# EAGLE schematic 1-13-2013 (EAGLE 6.4)
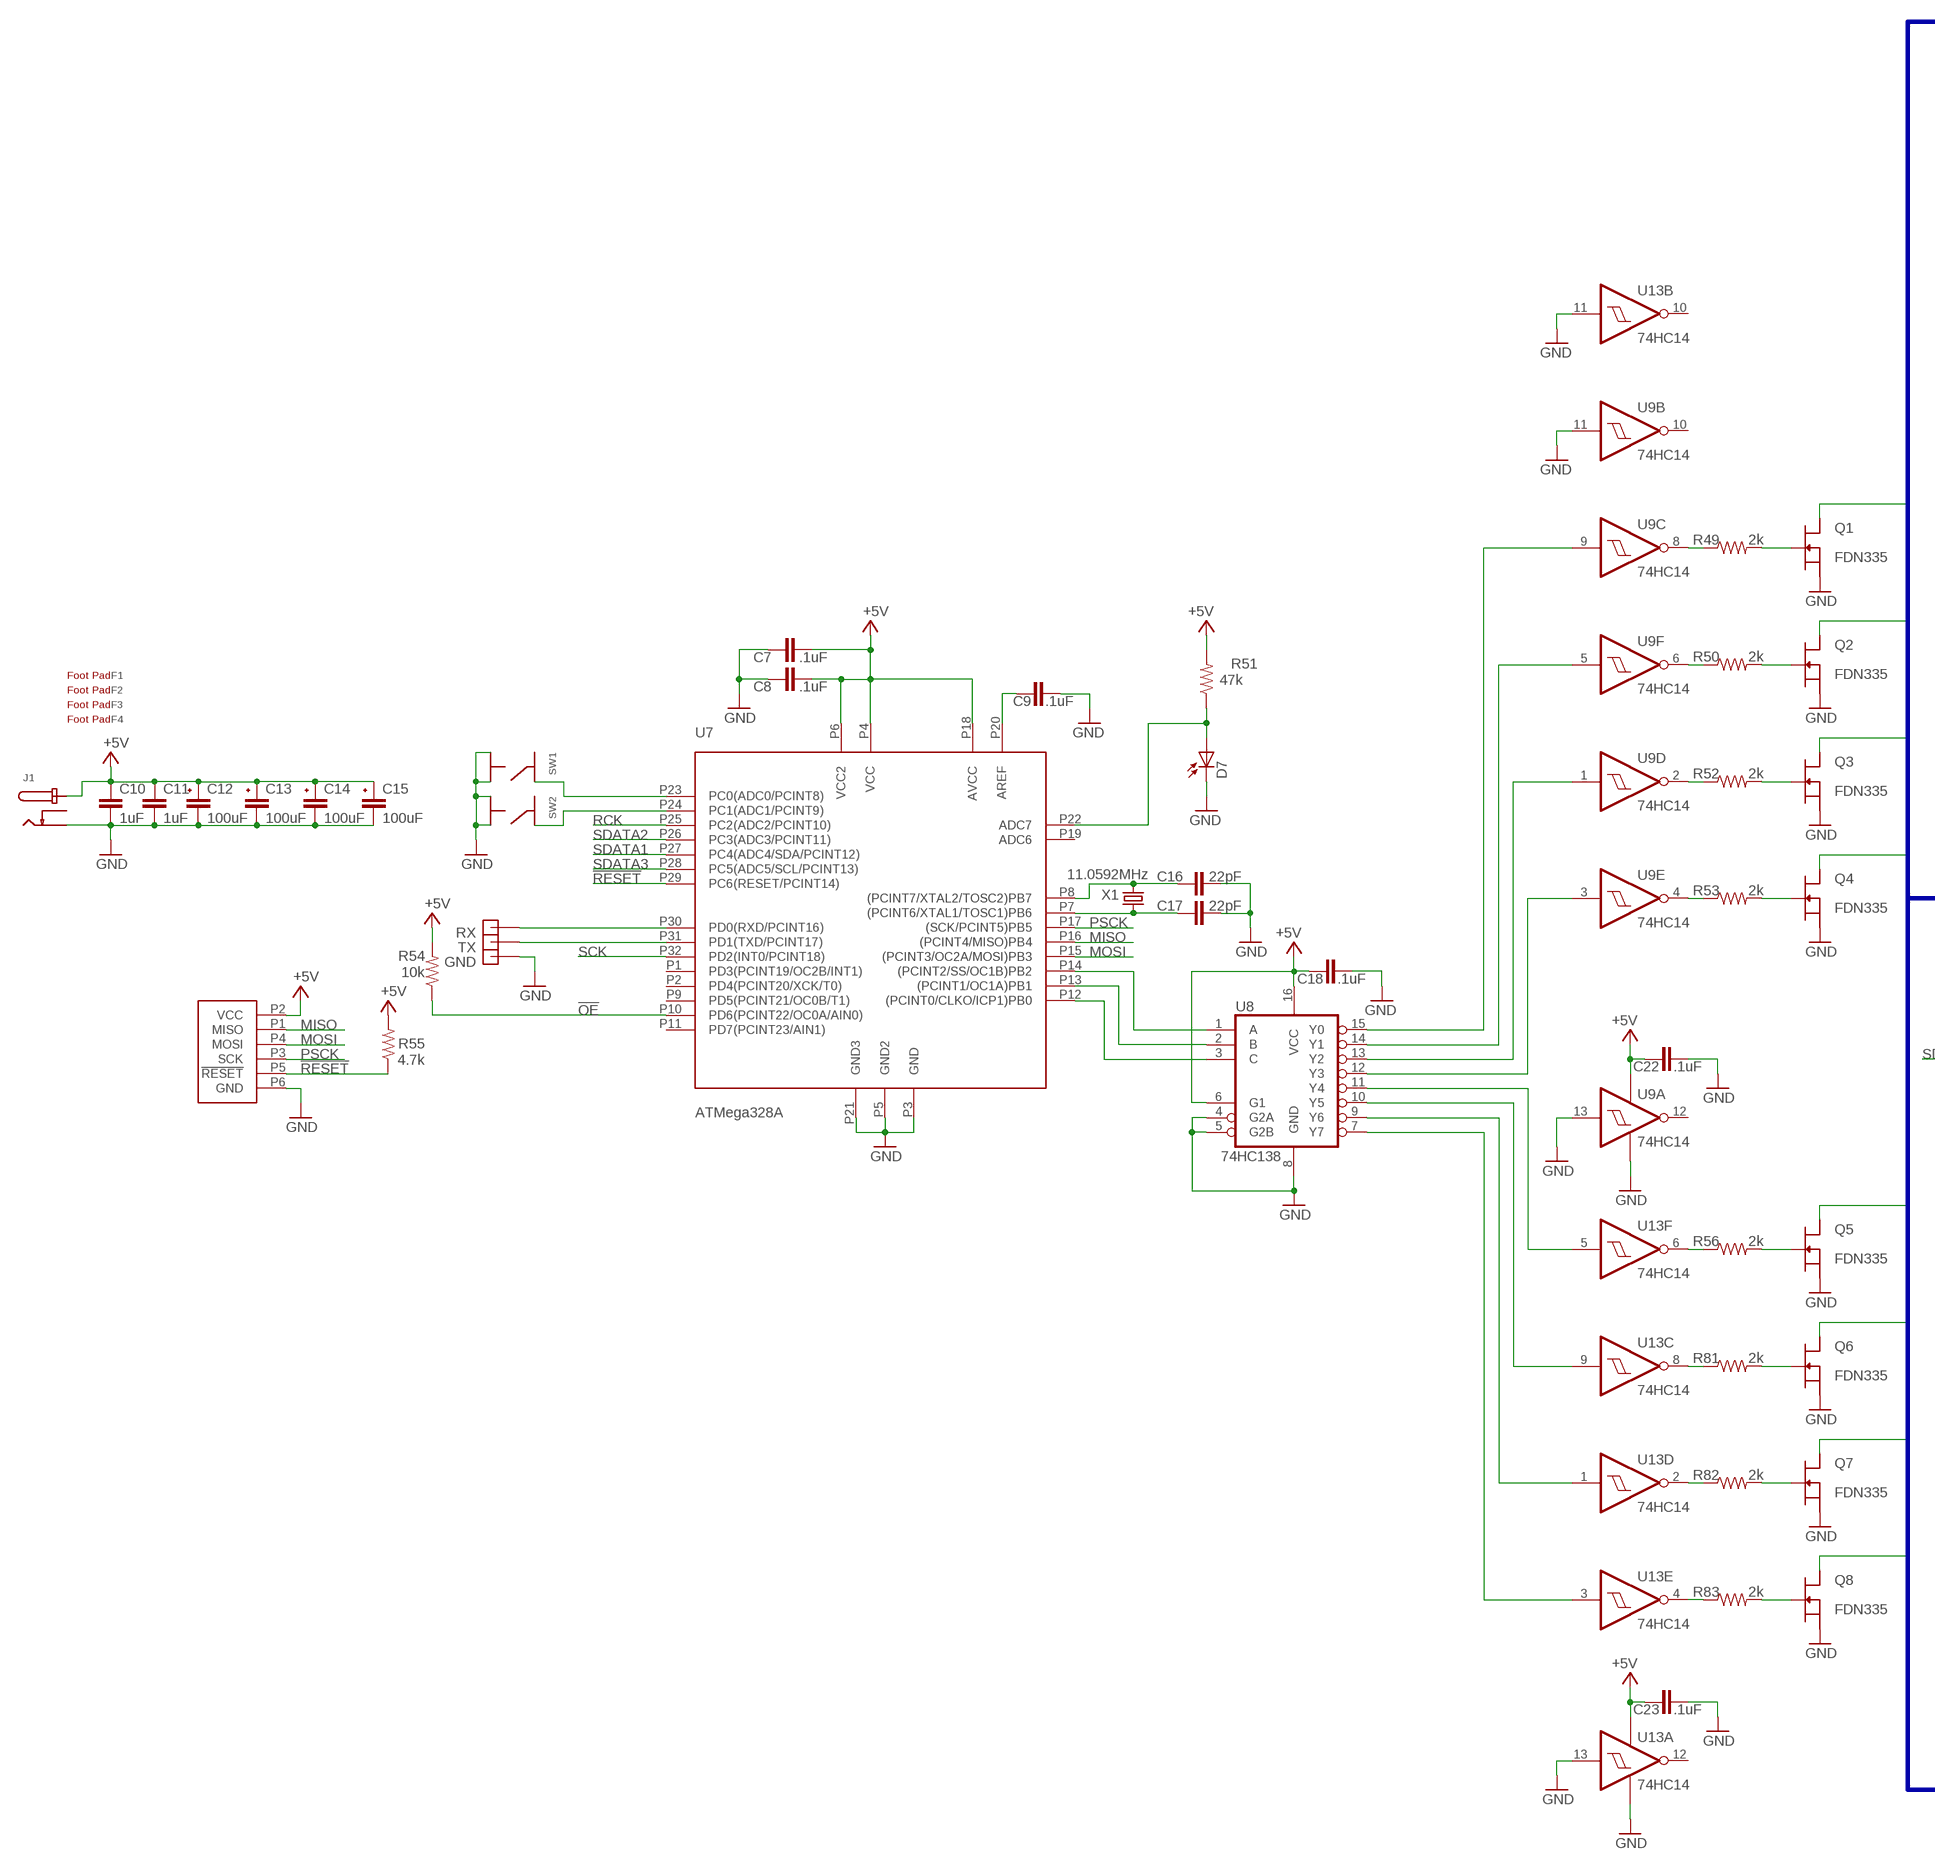
[diagram p0: schematic, sheet 1, part 1 of 2]
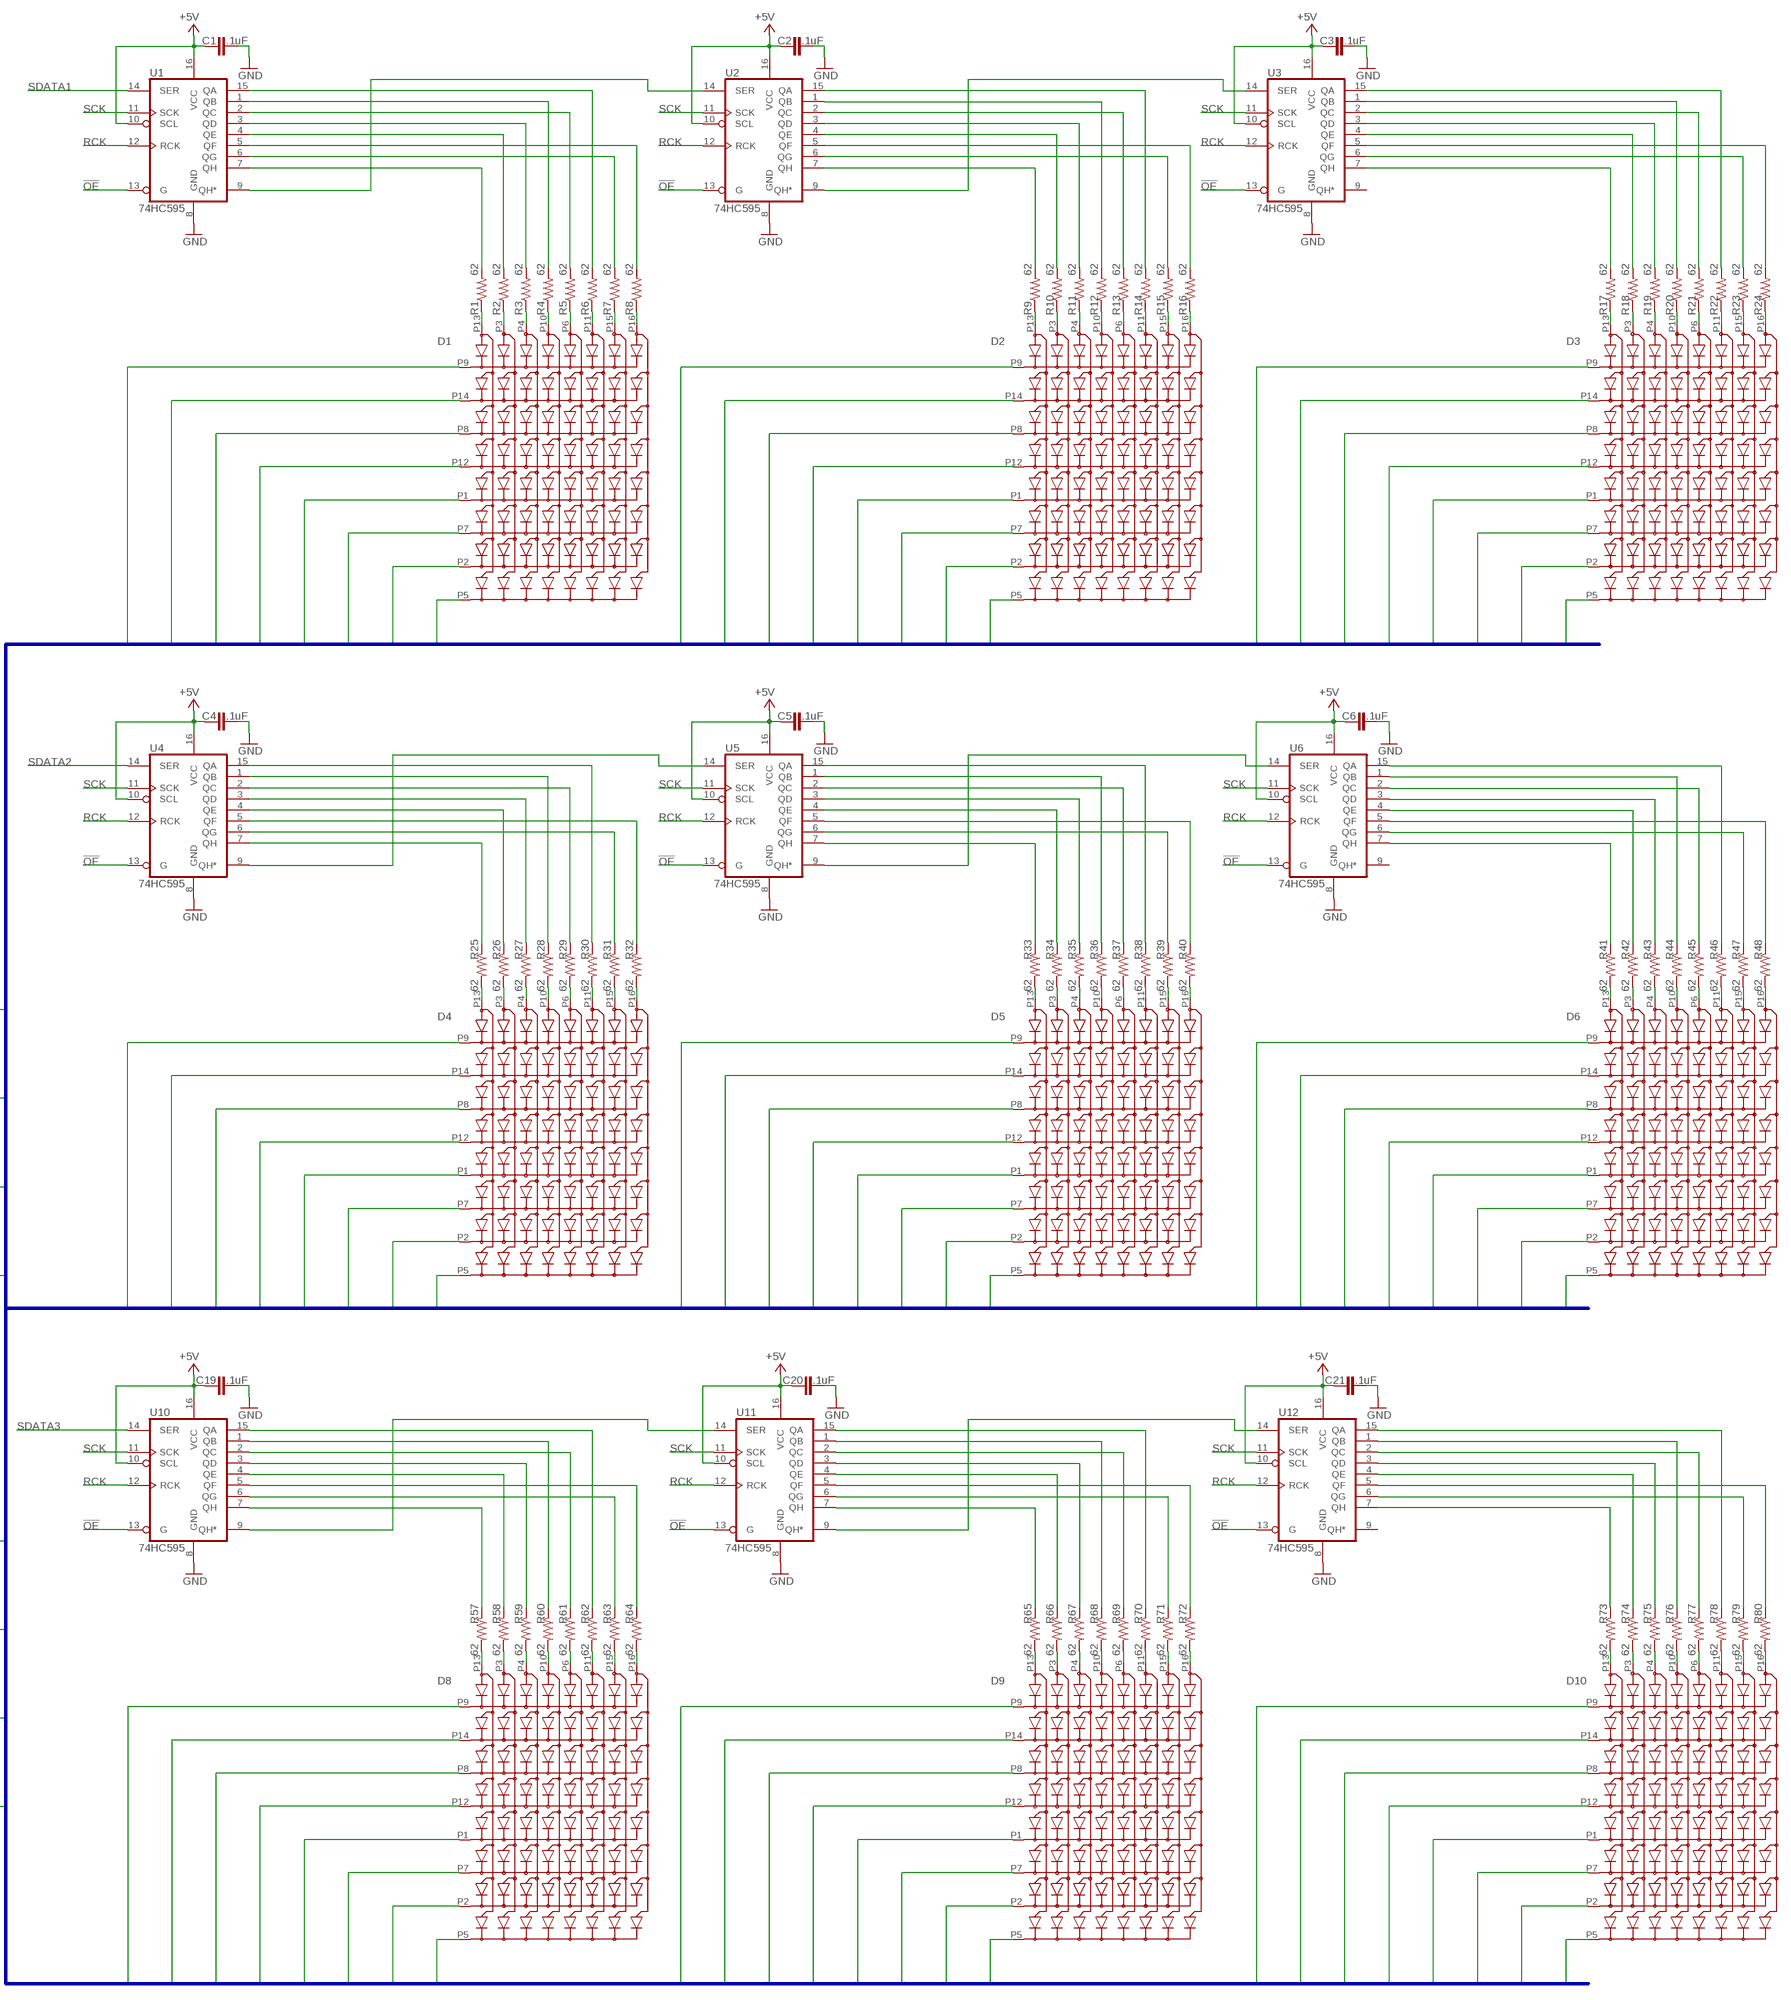
[diagram p1: schematic, sheet 1, part 2 of 2]

## Parts
C1  .1uF  CAPACITOR-.1UF  [0603/1608METRIC]
C2  .1uF  CAPACITOR-.1UF  [0603/1608METRIC]
C3  .1uF  CAPACITOR-.1UF  [0603/1608METRIC]
C4  .1uF  CAPACITOR-.1UF  [0603/1608METRIC]
C5  .1uF  CAPACITOR-.1UF  [0603/1608METRIC]
C6  .1uF  CAPACITOR-.1UF  [0603/1608METRIC]
C7  .1uF  CAPACITOR-.1UF  [0603/1608METRIC]
C8  .1uF  CAPACITOR-.1UF  [0603/1608METRIC]
C9  .1uF  CAPACITOR-.1UF  [0603/1608METRIC]
C10  1uF  CAPACITOR-1UF  [0603/1608METRIC]
C11  1uF  CAPACITOR-1UF  [0603/1608METRIC]
C12  100uF  ELEC-100UF-SMT  [CAP-UWX-6.3]
C13  100uF  ELEC-100UF-SMT  [CAP-UWX-6.3]
C14  100uF  ELEC-100UF-SMT  [CAP-UWX-6.3]
C15  100uF  ELEC-100UF-SMT  [CAP-UWX-6.3]
C16  22pF  CAPACITOR-22PF  [0603/1608METRIC]
C17  22pF  CAPACITOR-22PF  [0603/1608METRIC]
C18  .1uF  CAPACITOR-.1UF  [0603/1608METRIC]
C19  .1uF  CAPACITOR-.1UF  [0603/1608METRIC]
C20  .1uF  CAPACITOR-.1UF  [0603/1608METRIC]
C21  .1uF  CAPACITOR-.1UF  [0603/1608METRIC]
C22  .1uF  CAPACITOR-.1UF  [0603/1608METRIC]
C23  .1uF  CAPACITOR-.1UF  [0603/1608METRIC]
D1  WHITE  HS-2085AWND-  [HS-2085BX]
D2  WHITE  HS-2085AWND-  [HS-2085BX]
D3  WHITE  HS-2085AWND-  [HS-2085BX]
D4  WHITE  HS-2085AWND-  [HS-2085BX]
D5  WHITE  HS-2085AWND-  [HS-2085BX]
D6  WHITE  HS-2085AWND-  [HS-2085BX]
D7  TEPT4400  [LED3MM]
D8  WHITE  HS-2085AWND-  [HS-2085BX]
D9  WHITE  HS-2085AWND-  [HS-2085BX]
D10  WHITE  HS-2085AWND-  [HS-2085BX]
F1  RUBBER-FOOT  [SJ-5518]
F2  RUBBER-FOOT  [SJ-5518]
F3  RUBBER-FOOT  [SJ-5518]
F4  RUBBER-FOOT  [SJ-5518]
GND  HEADERPIN  [HEADERPIN]
J1  DC-BARREL-JACK-SWITCH  [PJ-075DH-SMT-TR]
J2  PROGHEADER-PINS  [ATMEL-PROGRAMMING-HEADER]
Q1  FDN335  [SOT23]
Q2  FDN335  [SOT23]
Q3  FDN335  [SOT23]
Q4  FDN335  [SOT23]
Q5  FDN335  [SOT23]
Q6  FDN335  [SOT23]
Q7  FDN335  [SOT23]
Q8  FDN335  [SOT23]
R1  62  RESISTOR-62-5%-0603  [0603/1608METRIC]
R2  62  RESISTOR-62-5%-0603  [0603/1608METRIC]
R3  62  RESISTOR-62-5%-0603  [0603/1608METRIC]
R4  62  RESISTOR-62-5%-0603  [0603/1608METRIC]
R5  62  RESISTOR-62-5%-0603  [0603/1608METRIC]
R6  62  RESISTOR-62-5%-0603  [0603/1608METRIC]
R7  62  RESISTOR-62-5%-0603  [0603/1608METRIC]
R8  62  RESISTOR-62-5%-0603  [0603/1608METRIC]
R9  62  RESISTOR-62-5%-0603  [0603/1608METRIC]
R10  62  RESISTOR-62-5%-0603  [0603/1608METRIC]
R11  62  RESISTOR-62-5%-0603  [0603/1608METRIC]
R12  62  RESISTOR-62-5%-0603  [0603/1608METRIC]
R13  62  RESISTOR-62-5%-0603  [0603/1608METRIC]
R14  62  RESISTOR-62-5%-0603  [0603/1608METRIC]
R15  62  RESISTOR-62-5%-0603  [0603/1608METRIC]
R16  62  RESISTOR-62-5%-0603  [0603/1608METRIC]
R17  62  RESISTOR-62-5%-0603  [0603/1608METRIC]
R18  62  RESISTOR-62-5%-0603  [0603/1608METRIC]
R19  62  RESISTOR-62-5%-0603  [0603/1608METRIC]
R20  62  RESISTOR-62-5%-0603  [0603/1608METRIC]
R21  62  RESISTOR-62-5%-0603  [0603/1608METRIC]
R22  62  RESISTOR-62-5%-0603  [0603/1608METRIC]
R23  62  RESISTOR-62-5%-0603  [0603/1608METRIC]
R24  62  RESISTOR-62-5%-0603  [0603/1608METRIC]
R25  62  RESISTOR-62-5%-0603  [0603/1608METRIC]
R26  62  RESISTOR-62-5%-0603  [0603/1608METRIC]
R27  62  RESISTOR-62-5%-0603  [0603/1608METRIC]
R28  62  RESISTOR-62-5%-0603  [0603/1608METRIC]
R29  62  RESISTOR-62-5%-0603  [0603/1608METRIC]
R30  62  RESISTOR-62-5%-0603  [0603/1608METRIC]
R31  62  RESISTOR-62-5%-0603  [0603/1608METRIC]
R32  62  RESISTOR-62-5%-0603  [0603/1608METRIC]
R33  62  RESISTOR-62-5%-0603  [0603/1608METRIC]
R34  62  RESISTOR-62-5%-0603  [0603/1608METRIC]
R35  62  RESISTOR-62-5%-0603  [0603/1608METRIC]
R36  62  RESISTOR-62-5%-0603  [0603/1608METRIC]
R37  62  RESISTOR-62-5%-0603  [0603/1608METRIC]
R38  62  RESISTOR-62-5%-0603  [0603/1608METRIC]
R39  62  RESISTOR-62-5%-0603  [0603/1608METRIC]
R40  62  RESISTOR-62-5%-0603  [0603/1608METRIC]
R41  62  RESISTOR-62-5%-0603  [0603/1608METRIC]
R42  62  RESISTOR-62-5%-0603  [0603/1608METRIC]
R43  62  RESISTOR-62-5%-0603  [0603/1608METRIC]
R44  62  RESISTOR-62-5%-0603  [0603/1608METRIC]
R45  62  RESISTOR-62-5%-0603  [0603/1608METRIC]
R46  62  RESISTOR-62-5%-0603  [0603/1608METRIC]
R47  62  RESISTOR-62-5%-0603  [0603/1608METRIC]
R48  62  RESISTOR-62-5%-0603  [0603/1608METRIC]
R49  2k  RESISTOR-2K-5%-0603  [0603/1608METRIC]
R50  2k  RESISTOR-2K-5%-0603  [0603/1608METRIC]
R51  47k  RESISTOR-47K-5%-0603  [0603/1608METRIC]
R52  2k  RESISTOR-2K-5%-0603  [0603/1608METRIC]
R53  2k  RESISTOR-2K-5%-0603  [0603/1608METRIC]
R54  10k  RESISTOR-10K-5%-0603  [0603/1608METRIC]
R55  4.7k  RESISTOR-4.7K-5%-0603  [0603/1608METRIC]
R56  2k  RESISTOR-2K-5%-0603  [0603/1608METRIC]
R57  62  RESISTOR-62-5%-0603  [0603/1608METRIC]
R58  62  RESISTOR-62-5%-0603  [0603/1608METRIC]
R59  62  RESISTOR-62-5%-0603  [0603/1608METRIC]
R60  62  RESISTOR-62-5%-0603  [0603/1608METRIC]
R61  62  RESISTOR-62-5%-0603  [0603/1608METRIC]
R62  62  RESISTOR-62-5%-0603  [0603/1608METRIC]
R63  62  RESISTOR-62-5%-0603  [0603/1608METRIC]
R64  62  RESISTOR-62-5%-0603  [0603/1608METRIC]
R65  62  RESISTOR-62-5%-0603  [0603/1608METRIC]
R66  62  RESISTOR-62-5%-0603  [0603/1608METRIC]
R67  62  RESISTOR-62-5%-0603  [0603/1608METRIC]
R68  62  RESISTOR-62-5%-0603  [0603/1608METRIC]
R69  62  RESISTOR-62-5%-0603  [0603/1608METRIC]
R70  62  RESISTOR-62-5%-0603  [0603/1608METRIC]
R71  62  RESISTOR-62-5%-0603  [0603/1608METRIC]
R72  62  RESISTOR-62-5%-0603  [0603/1608METRIC]
R73  62  RESISTOR-62-5%-0603  [0603/1608METRIC]
R74  62  RESISTOR-62-5%-0603  [0603/1608METRIC]
R75  62  RESISTOR-62-5%-0603  [0603/1608METRIC]
R76  62  RESISTOR-62-5%-0603  [0603/1608METRIC]
R77  62  RESISTOR-62-5%-0603  [0603/1608METRIC]
R78  62  RESISTOR-62-5%-0603  [0603/1608METRIC]
R79  62  RESISTOR-62-5%-0603  [0603/1608METRIC]
R80  62  RESISTOR-62-5%-0603  [0603/1608METRIC]
R81  2k  RESISTOR-2K-5%-0603  [0603/1608METRIC]
R82  2k  RESISTOR-2K-5%-0603  [0603/1608METRIC]
R83  2k  RESISTOR-2K-5%-0603  [0603/1608METRIC]
RX  HEADERPIN  [HEADERPIN]
SW1  4mm  SWITCH-TACT-SM  [PTS645SM43SMTRLFS]
SW2  4mm  SWITCH-TACT-SM  [PTS645SM43SMTRLFS]
TX  HEADERPIN  [HEADERPIN]
U1  74HC595  74HC595-SOIC  [SO16]
U2  74HC595  74HC595-SOIC  [SO16]
U3  74HC595  74HC595-SOIC  [SO16]
U4  74HC595  74HC595-SOIC  [SO16]
U5  74HC595  74HC595-SOIC  [SO16]
U6  74HC595  74HC595-SOIC  [SO16]
U7  ATMega328A  ATMEGA328A  [TQFP-32]
U8  74HC138  74HC138-SOIC  [SO16]
U9  74HC14  74HC14-SOIC  [SO14]
U10  74HC595  74HC595-SOIC  [SO16]
U11  74HC595  74HC595-SOIC  [SO16]
U12  74HC595  74HC595-SOIC  [SO16]
U13  74HC14  74HC14-SOIC  [SO14]
X1  11.0592MHz  XTAL9C-T  [HC49UP]

## Nets
!OE: R54.P1 U1.13(G) U2.13(G) U3.13(G) U4.13(G) U5.13(G) U6.13(G) U7.P10(PD6(PCINT22/OC0A/AIN0)) U10.13(G) U11.13(G) U12.13(G)
!RESET: J2.P5(!RESET) R55.P1 U7.P29(PC6(RESET/PCINT14))
+5V: C1.P1 C2.P1 C3.P1 C4.P1 C5.P1 C6.P1 C7.P1 C8.P1 C10.P1 C11.P1 C12.+ C13.+ C14.+ C15.+ C18.P1 C19.P1 C20.P1 C21.P1 C22.P1 C23.P1 J1.1(PIN) J2.P2(VCC) R51.P2 R54.P2 R55.P2 U1.10(SCL) U1.16(VCC) U2.10(SCL) U2.16(VCC) U3.10(SCL) U3.16(VCC) U4.10(SCL) U4.16(VCC) U5.10(SCL) U5.16(VCC) U6.10(SCL) U6.16(VCC) U7.P4(VCC) U7.P6(VCC2) U7.P18(AVCC) U8.6(G1) U8.16(VCC) U9.14(A:VCC) U10.10(SCL) U10.16(VCC) U11.10(SCL) U11.16(VCC) U12.10(SCL) U12.16(VCC) U13.14(A:VCC)
GND: C1.P2 C2.P2 C3.P2 C4.P2 C5.P2 C6.P2 C7.P2 C8.P2 C9.P2 C10.P2 C11.P2 C12.- C13.- C14.- C15.- C16.P2 C17.P2 C18.P2 C19.P2 C20.P2 C21.P2 C22.P2 C23.P2 D7.K(C) GND.P$1 J1.2(BARREL) J2.P6(GND) Q1.2(S) Q2.2(S) Q3.2(S) Q4.2(S) Q5.2(S) Q6.2(S) Q7.2(S) Q8.2(S) SW1.P3 SW1.P4 SW2.P3 SW2.P4 U1.8(GND) U2.8(GND) U3.8(GND) U4.8(GND) U5.8(GND) U6.8(GND) U7.P3(GND) U7.P5(GND2) U7.P21(GND3) U8.4(G2A) U8.5(G2B) U8.8(GND) U9.7(A:GND) U9.11(B:I) U9.13(A:I) U10.8(GND) U11.8(GND) U12.8(GND) U13.7(A:GND) U13.11(B:I) U13.13(A:I)
MISO: J2.P1(MISO) U7.P16((PCINT4/MISO)PB4)
MOSI: J2.P4(MOSI) U7.P15((PCINT3/OC2A/MOSI)PB3)
N$1: D1.P13(C1) R1.P1
N$2: R4.P2 U1.1(QB)
N$3: D1.P3(C2) R2.P1
N$4: R5.P2 U1.2(QC)
N$5: D1.P4(C3) R3.P1
N$6: R14.P2 U2.15(QA)
N$7: D1.P10(C4) R4.P1
N$8: R13.P2 U2.2(QC)
N$9: D1.P6(C5) R5.P1
N$10: R12.P2 U2.1(QB)
N$11: D1.P11(C6) R6.P1
N$12: R11.P2 U2.3(QD)
N$13: D1.P15(C7) R7.P1
N$14: R10.P2 U2.4(QE)
N$15: D1.P16(C8) R8.P1
N$16: R16.P2 U2.5(QF)
N$17: U8.15(Y0) U9.9(C:I)
N$18: D2.P13(C1) R9.P1
N$19: R21.P2 U3.2(QC)
N$20: D2.P3(C2) R10.P1
N$21: R20.P2 U3.1(QB)
N$22: D2.P4(C3) R11.P1
N$23: R19.P2 U3.3(QD)
N$24: D2.P10(C4) R12.P1
N$25: R18.P2 U3.4(QE)
N$26: D2.P6(C5) R13.P1
N$27: R24.P2 U3.5(QF)
N$28: D2.P11(C6) R14.P1
N$29: R32.P1 U4.5(QF)
N$30: D2.P15(C7) R15.P1
N$31: R25.P1 U4.7(QH)
N$32: D2.P16(C8) R16.P1
N$33: R52.P1 U9.2(D:O)
N$34: R50.P1 U9.6(F:O)
N$35: R49.P1 U9.8(C:O)
N$36: R53.P1 U9.4(E:O)
N$37: R83.P1 U13.4(E:O)
N$38: R82.P1 U13.2(D:O)
N$39: R81.P1 U13.8(C:O)
N$40: R56.P1 U13.6(F:O)
N$41: C17.P1 U7.P7((PCINT6/XTAL1/TOSC1)PB6) X1.1
N$42: R7.P2 U1.6(QG)
N$43: TX.P$1 U7.P31(PD1(TXD/PCINT17))
N$44: C16.P1 U7.P8((PCINT7/XTAL2/TOSC2)PB7) X1.2
N$45: RX.P$1 U7.P30(PD0(RXD/PCINT16))
N$46: Q3.1(G) R52.P2
N$47: SW2.P2 U7.P24(PC1(ADC1/PCINT9))
N$48: SW1.P2 U7.P23(PC0(ADC0/PCINT8))
N$49: R1.P2 U1.7(QH)
N$50: Q1.1(G) R49.P2
N$51: R8.P2 U1.5(QF)
N$52: R2.P2 U1.4(QE)
N$53: R3.P2 U1.3(QD)
N$54: R31.P1 U4.6(QG)
N$55: R26.P1 U4.4(QE)
N$56: R6.P2 U1.15(QA)
N$57: R27.P1 U4.3(QD)
N$58: R29.P1 U4.2(QC)
N$59: R30.P1 U4.15(QA)
N$60: R33.P1 U5.7(QH)
N$61: R39.P1 U5.6(QG)
N$62: R40.P1 U5.5(QF)
N$63: R34.P1 U5.4(QE)
N$64: R35.P1 U5.3(QD)
N$65: R36.P1 U5.1(QB)
N$66: R37.P1 U5.2(QC)
N$67: R38.P1 U5.15(QA)
N$68: R41.P1 U6.7(QH)
N$69: R47.P1 U6.6(QG)
N$70: R46.P1 U6.15(QA)
N$71: R45.P1 U6.2(QC)
N$72: R44.P1 U6.1(QB)
N$73: R43.P1 U6.3(QD)
N$74: U8.14(Y1) U9.5(F:I)
N$75: U4.9(QH*) U5.14(SER)
N$76: U5.9(QH*) U6.14(SER)
N$77: U8.13(Y2) U9.1(D:I)
N$78: U1.9(QH*) U2.14(SER)
N$79: U2.9(QH*) U3.14(SER)
N$80: R42.P1 U6.4(QE)
N$81: R48.P1 U6.5(QF)
N$82: R57.P1 U10.7(QH)
N$83: R63.P1 U10.6(QG)
N$84: R64.P1 U10.5(QF)
N$85: R58.P1 U10.4(QE)
N$86: R59.P1 U10.3(QD)
N$87: R15.P2 U2.6(QG)
N$88: R61.P1 U10.2(QC)
N$89: R60.P1 U10.1(QB)
N$90: R62.P1 U10.15(QA)
N$91: R65.P1 U11.7(QH)
N$92: R71.P1 U11.6(QG)
N$93: R72.P1 U11.5(QF)
N$94: R66.P1 U11.4(QE)
N$95: R67.P1 U11.3(QD)
N$96: R69.P1 U11.2(QC)
N$97: R9.P2 U2.7(QH)
N$98: R68.P1 U11.1(QB)
N$99: R70.P1 U11.15(QA)
N$100: R73.P1 U12.7(QH)
N$101: R79.P1 U12.6(QG)
N$102: R80.P1 U12.5(QF)
N$103: R74.P1 U12.4(QE)
N$104: R75.P1 U12.3(QD)
N$105: R77.P1 U12.2(QC)
N$106: R76.P1 U12.1(QB)
N$107: R78.P1 U12.15(QA)
N$121: U10.9(QH*) U11.14(SER)
N$122: U11.9(QH*) U12.14(SER)
N$123: U8.12(Y3) U9.3(E:I)
N$124: U8.11(Y4) U13.5(F:I)
N$125: U8.10(Y5) U13.9(C:I)
N$126: U8.9(Y6) U13.1(D:I)
N$127: U8.7(Y7) U13.3(E:I)
N$128: D7.A R51.P1 U7.P22(ADC7)
N$129: D3.P13(C1) R17.P1
N$131: D3.P3(C2) R18.P1
N$133: D3.P4(C3) R19.P1
N$135: D3.P10(C4) R20.P1
N$137: D3.P6(C5) R21.P1
N$139: D3.P11(C6) R22.P1
N$141: D3.P15(C7) R23.P1
N$143: D3.P16(C8) R24.P1
N$161: R17.P2 U3.7(QH)
N$162: R23.P2 U3.6(QG)
N$168: R22.P2 U3.15(QA)
N$185: U7.P12((PCINT0/CLKO/ICP1)PB0) U8.3(C)
N$186: U7.P13((PCINT1/OC1A)PB1) U8.2(B)
N$187: U7.P14((PCINT2/SS/OC1B)PB2) U8.1(A)
N$188: C9.P1 U7.P20(AREF)
N$193: D4.P13(C1) R25.P2
N$195: D4.P3(C2) R26.P2
N$197: D4.P4(C3) R27.P2
N$199: D4.P10(C4) R28.P2
N$201: D4.P6(C5) R29.P2
N$203: D4.P11(C6) R30.P2
N$205: D4.P15(C7) R31.P2
N$207: D4.P16(C8) R32.P2
N$210: R28.P1 U4.1(QB)
N$242: Q7.1(G) R82.P2
N$243: Q2.1(G) R50.P2
N$245: Q4.1(G) R53.P2
N$246: Q5.1(G) R56.P2
N$247: Q6.1(G) R81.P2
N$248: Q8.1(G) R83.P2
N$252: D5.P13(C1) R33.P2
N$254: D5.P3(C2) R34.P2
N$256: D5.P4(C3) R35.P2
N$258: D5.P10(C4) R36.P2
N$260: D5.P6(C5) R37.P2
N$262: D5.P11(C6) R38.P2
N$264: D5.P15(C7) R39.P2
N$266: D5.P16(C8) R40.P2
N$308: D6.P13(C1) R41.P2
N$310: D6.P3(C2) R42.P2
N$312: D6.P4(C3) R43.P2
N$314: D6.P10(C4) R44.P2
N$316: D6.P6(C5) R45.P2
N$318: D6.P11(C6) R46.P2
N$320: D6.P15(C7) R47.P2
N$322: D6.P16(C8) R48.P2
N$369: D8.P13(C1) R57.P2
N$371: D8.P3(C2) R58.P2
N$373: D8.P4(C3) R59.P2
N$375: D8.P10(C4) R60.P2
N$377: D8.P6(C5) R61.P2
N$379: D8.P11(C6) R62.P2
N$381: D8.P15(C7) R63.P2
N$383: D8.P16(C8) R64.P2
N$428: D9.P13(C1) R65.P2
N$430: D9.P3(C2) R66.P2
N$432: D9.P4(C3) R67.P2
N$434: D9.P10(C4) R68.P2
N$436: D9.P6(C5) R69.P2
N$438: D9.P11(C6) R70.P2
N$440: D9.P15(C7) R71.P2
N$442: D9.P16(C8) R72.P2
N$484: D10.P13(C1) R73.P2
N$486: D10.P3(C2) R74.P2
N$488: D10.P4(C3) R75.P2
N$490: D10.P10(C4) R76.P2
N$492: D10.P6(C5) R77.P2
N$494: D10.P11(C6) R78.P2
N$496: D10.P15(C7) R79.P2
N$498: D10.P16(C8) R80.P2
PSCK: J2.P3(SCK) U7.P17((SCK/PCINT5)PB5)
RCK: U1.12(RCK) U2.12(RCK) U3.12(RCK) U4.12(RCK) U5.12(RCK) U6.12(RCK) U7.P25(PC2(ADC2/PCINT10)) U10.12(RCK) U11.12(RCK) U12.12(RCK)
ROW0: D1.P9(R1) D2.P9(R1) D3.P9(R1) D4.P9(R1) D5.P9(R1) D6.P9(R1) D8.P9(R1) D9.P9(R1) D10.P9(R1) Q1.3(D)
ROW1: D1.P14(R2) D2.P14(R2) D3.P14(R2) D4.P14(R2) D5.P14(R2) D6.P14(R2) D8.P14(R2) D9.P14(R2) D10.P14(R2) Q2.3(D)
ROW2: D1.P8(R3) D2.P8(R3) D3.P8(R3) D4.P8(R3) D5.P8(R3) D6.P8(R3) D8.P8(R3) D9.P8(R3) D10.P8(R3) Q3.3(D)
ROW3: D1.P12(R4) D2.P12(R4) D3.P12(R4) D4.P12(R4) D5.P12(R4) D6.P12(R4) D8.P12(R4) D9.P12(R4) D10.P12(R4) Q4.3(D)
ROW4: D1.P1(R5) D2.P1(R5) D3.P1(R5) D4.P1(R5) D5.P1(R5) D6.P1(R5) D8.P1(R5) D9.P1(R5) D10.P1(R5) Q5.3(D)
ROW5: D1.P7(R6) D2.P7(R6) D3.P7(R6) D4.P7(R6) D5.P7(R6) D6.P7(R6) D8.P7(R6) D9.P7(R6) D10.P7(R6) Q6.3(D)
ROW6: D1.P2(R7) D2.P2(R7) D3.P2(R7) D4.P2(R7) D5.P2(R7) D6.P2(R7) D8.P2(R7) D9.P2(R7) D10.P2(R7) Q7.3(D)
ROW7: D1.P5(R8) D2.P5(R8) D3.P5(R8) D4.P5(R8) D5.P5(R8) D6.P5(R8) D8.P5(R8) D9.P5(R8) D10.P5(R8) Q8.3(D)
SCK: U1.11(SCK) U2.11(SCK) U3.11(SCK) U4.11(SCK) U5.11(SCK) U6.11(SCK) U7.P32(PD2(INT0/PCINT18)) U10.11(SCK) U11.11(SCK) U12.11(SCK)
SDATA1: U1.14(SER) U7.P27(PC4(ADC4/SDA/PCINT12))
SDATA2: U4.14(SER) U7.P26(PC3(ADC3/PCINT11))
SDATA3: U7.P28(PC5(ADC5/SCL/PCINT13)) U10.14(SER)
Unconnected: J1.3(SWITCH) SW1.P1 SW2.P1 U3.9(QH*) U6.9(QH*) U7.P1(PD3(PCINT19/OC2B/INT1)) U7.P2(PD4(PCINT20/XCK/T0)) U7.P9(PD5(PCINT21/OC0B/T1)) U7.P11(PD7(PCINT23/AIN1)) U7.P19(ADC6) U9.10(B:O) U9.12(A:O) U12.9(QH*) U13.10(B:O) U13.12(A:O)

## Buses
ROW[0..7]

## Library data of the parts
C1-C9 C18-C23 = ciuffocapacitor:CAPACITOR-*: Capacitor; DISTRIBUTOR: Digikey; DISTRIBUTORPARTNO: 478-1239-1-ND; MANUFACTURER: AVX Corporation; MNT-TYPE: SM; NO-PINS: 2; PACKAGE: 0603 (1608 Metric); TOLERANCE: 10%
C10 C11 = ciuffocapacitor:CAPACITOR-*: Capacitor; DISTRIBUTOR: Digikey; DISTRIBUTORPARTNO: 445-1328-1-ND; MANUFACTURER: TDK CORPORATION; MNT-TYPE: SM; NO-PINS: 2; PACKAGE: 0603 (1608 Metric); TOLERANCE: 20%; VOLTAGE: 10V
C12-C15 = ciuffocapacitor:ELEC-*; DESCRIPTION: CAP ALUM 100UF 16V 20% SMD; DISTRIBUTOR: Digikey; DISTRIBUTORPARTNO: 493-2105-1-ND; MANPARTNO: UWX1C101MCL1GB; MANUFACTURER: Nichicon; MNT-TYPE: SM; NO-PINS: 2; PACKAGE: RADIAL-SMT
C16 C17 = ciuffocapacitor:CAPACITOR-*: Capacitor; DESCRIPTION: CAP CER 22PF 25V 5% NP0 0603; DISTRIBUTOR: Digikey; DISTRIBUTORPARTNO: 478-6200-1-ND; MANPARTNO: 06033A220JAT2A; MANUFACTURER: AVX Corporation; MNT-TYPE: SM; NO-PINS: 2; PACKAGE: 0603 (1608 Metric); TOLERANCE: 5%; VOLTAGE: 25V
D1-D6 D8-D10 = ciuffoLED:HS-2085A*ND: 8X8 RED LED matrix display. Common cathode.; DESCRIPTION: 8x8 White LED matrix; DISTRIBUTOR: Xindali Electronics; DISTRIBUTORPARTNO: HS-2085AWND; MANPARTNO: HS-2085AWND; MANUFACTURER: XINDALI ELECTRONICS; MNT-TYPE: TH; NO-PINS: 16
D7 = ciuffodiscrete:TEPT4400: Photo Transistor; DISTRIBUTOR: Digikey; DISTRIBUTORPARTNO: 751-1057-ND; MANPARTNO: TEPT4400; MANUFACTURER: Vishay Semiconductors; MNT-TYPE: TH; PACKAGE: 3MMLED
F1-F4 = ciuffomisc:RUBBER-FOOT; DESCRIPTION: BUMPON TALL TAPER SQ .50X.23 BK; DISTRIBUTOR: Digikey; DISTRIBUTORPARTNO: SJ5518-0-ND; MANPARTNO: SJ-5518 (BLACK); MANUFACTURER: 3M
GND RX TX = ciuffomisc:HEADERPIN: .031" PIN
J1 = ciuffomisc:DC-BARREL-JACK-SWITCH; DESCRIPTION: CONN PWR JACK 1.3X3.4MM SMT; DISTRIBUTOR: Digikey; DISTRIBUTORPARTNO: CP-075DHPJCT-ND; MANPARTNO: PJ-075DH-SMT-TR; MANUFACTURER: CUI Inc; MNT-TYPE: SM; NO-PINS: 5
J2 = ciuffomisc:PROGHEADER; DESCRIPTION: CONN HEADER 100POS .100" DL TIN; DISTRIBUTOR: Digikey; DISTRIBUTORPARTNO: xxSAM1048-50-NDxx; MANPARTNO: TSW-150-08-T-D; MANUFACTURER: Samtec Inc.; MNT-TYPE: TH; NO-PINS: 6
Q1-Q8 = ciuffodiscrete:FDN335: SOT-23 N CHANNEL MOSFET NFET; DESCRIPTION: MOSFET N-CH 20V 1.7A SSOT3; DISTRIBUTOR: Digikey; DISTRIBUTORPARTNO: FDN335NCT-ND; MANPARTNO: FDN335N; MANUFACTURER: Fairchild Semiconductor; MNT-TYPE: SMT; NO-PINS: 3; PACKAGE: SOT23
R1-R48 R57-R80 = ciufforesistor:RESISTOR-*-5%-: Resistor; DESCRIPTION: RES 62 OHM 1/10W 5% 0603 SMD; DISTRIBUTOR: Digikey; DISTRIBUTORPARTNO: 311-62GRCT-ND; MANPARTNO: RC0603JR-0762RL; MANUFACTURER: Yaego; MNT-TYPE: SM; NO-PINS: 2; PACKAGE: 0603 (16080 Metric); TOLERANCE: 5%
R49 R50 R52 R53 R56 R81-R83 = ciufforesistor:RESISTOR-*-5%-: Resistor; DISTRIBUTOR: Digikey; DISTRIBUTORPARTNO: 311-2.0KGRCT-ND; MANPARTNO: RC0603JR-072KL; MANUFACTURER: Yaego; MNT-TYPE: SM; NO-PINS: 2; PACKAGE: 0603 (1608 Metric); TOLERANCE: 5%
R51 = ciufforesistor:RESISTOR-*-5%-: Resistor; DISTRIBUTOR: Digikey; DISTRIBUTORPARTNO: 311-47KGRCT-ND; MANPARTNO: RC0603JR-0747KL; MANUFACTURER: Yaego; MNT-TYPE: SM; NO-PINS: 2; PACKAGE: 0603 (1608 Metric); TOLERANCE: 5%
R54 = ciufforesistor:RESISTOR-*-5%-: Resistor; DISTRIBUTOR: Digikey; DISTRIBUTORPARTNO: 311-10KGRCT-ND; MANPARTNO: RC0603JR-0710KL; MANUFACTURER: Yaego; MNT-TYPE: SM; NO-PINS: 2; PACKAGE: 0603 (1608 Metric); TOLERANCE: 5%
R55 = ciufforesistor:RESISTOR-*-5%-: Resistor; DISTRIBUTOR: Digikey; DISTRIBUTORPARTNO: 311-4.7kGRCT-ND; MANPARTNO: RC0603JR-074K7L; MANUFACTURER: Yaego; MNT-TYPE: SM; NO-PINS: 2; PACKAGE: 0603 (1608 Metric); TOLERANCE: 5%
SW1 SW2 = ciuffomisc:SWITCH-TACT-SM: Tactile switch; DESCRIPTION: SWITCH TACTILE SPST-NO 0.05A 12V; DISTRIBUTOR: Digikey; DISTRIBUTORPARTNO: CKN9112CT-ND; MANPARTNO: PTS645SM43SMTR LFS; MANUFACTURER: C&K Components; MNT-TYPE: SM; NO-PINS: 4
U1-U6 U10-U12 = ciuffoIC:74*595: 8-bit SHIFT REGISTER, output latch DATASHEET <parts/ICs/sn74hc595>; DISTRIBUTOR: Digikey; DISTRIBUTORPARTNO: 296-14857-1-ND; MANPARTNO: SN74HC595DR; MANUFACTURER: Texas Instruments; MNT-TYPE: SM; NO-PINS: 16; PACKAGE: 16 SOIC
U7 = ciuffoIC:ATMEGA*A: ATMEGA48A microcontroller; DISTRIBUTOR: Digikey; DISTRIBUTORPARTNO: ATMEGA328-AU-ND; MANPARTNO: ATMEGA328-AU; MANUFACTURER: Atmel; MNT-TYPE: SM; NO-PINS: 32; PACKAGE: TQFP-32
U8 = ciuffoIC:74*138: 3-line to 8-line DECODER/DEMULTIPLEXER; DISTRIBUTOR: Digikey; DISTRIBUTORPARTNO: MC74HC138ADGOS-ND; MANPARTNO: MC74HC138ADG; MANUFACTURER: ON Semiconductor; MNT-TYPE: SM; NO-PINS: 16; PACKAGE: 16 SOIC
U9 U13 = ciuffoIC:74*14: Hex schmitt trigger INVERTER; DISTRIBUTOR: Digikey; DISTRIBUTORPARTNO: 296-9179-1-ND; MANPARTNO: CD74HC14M96; MANUFACTURER: Texas Instruments; MNT-TYPE: TH; NO-PINS: 14; PACKAGE: 14 SOIC
X1 = ciuffomisc:XTAL; DESCRIPTION: CRYSTAL 11.0592 MHZ 18PF SMD; DISTRIBUTOR: Digikey; DISTRIBUTORPARTNO: 887-1266-1-ND; MANPARTNO: 9C-11.0592MEEJ-T; MANUFACTURER: TXC CORPORATION; MNT-TYPE: SM; NO-PINS: 2; PACKAGE: HC49/US